# Altium schematic sheet Sheet_CL-TPI-01.SchDoc: Three-phase Inverter
size A3; Author: Canaan Lv; DocumentNumber: CL-TPI-01; Revision: v1.1
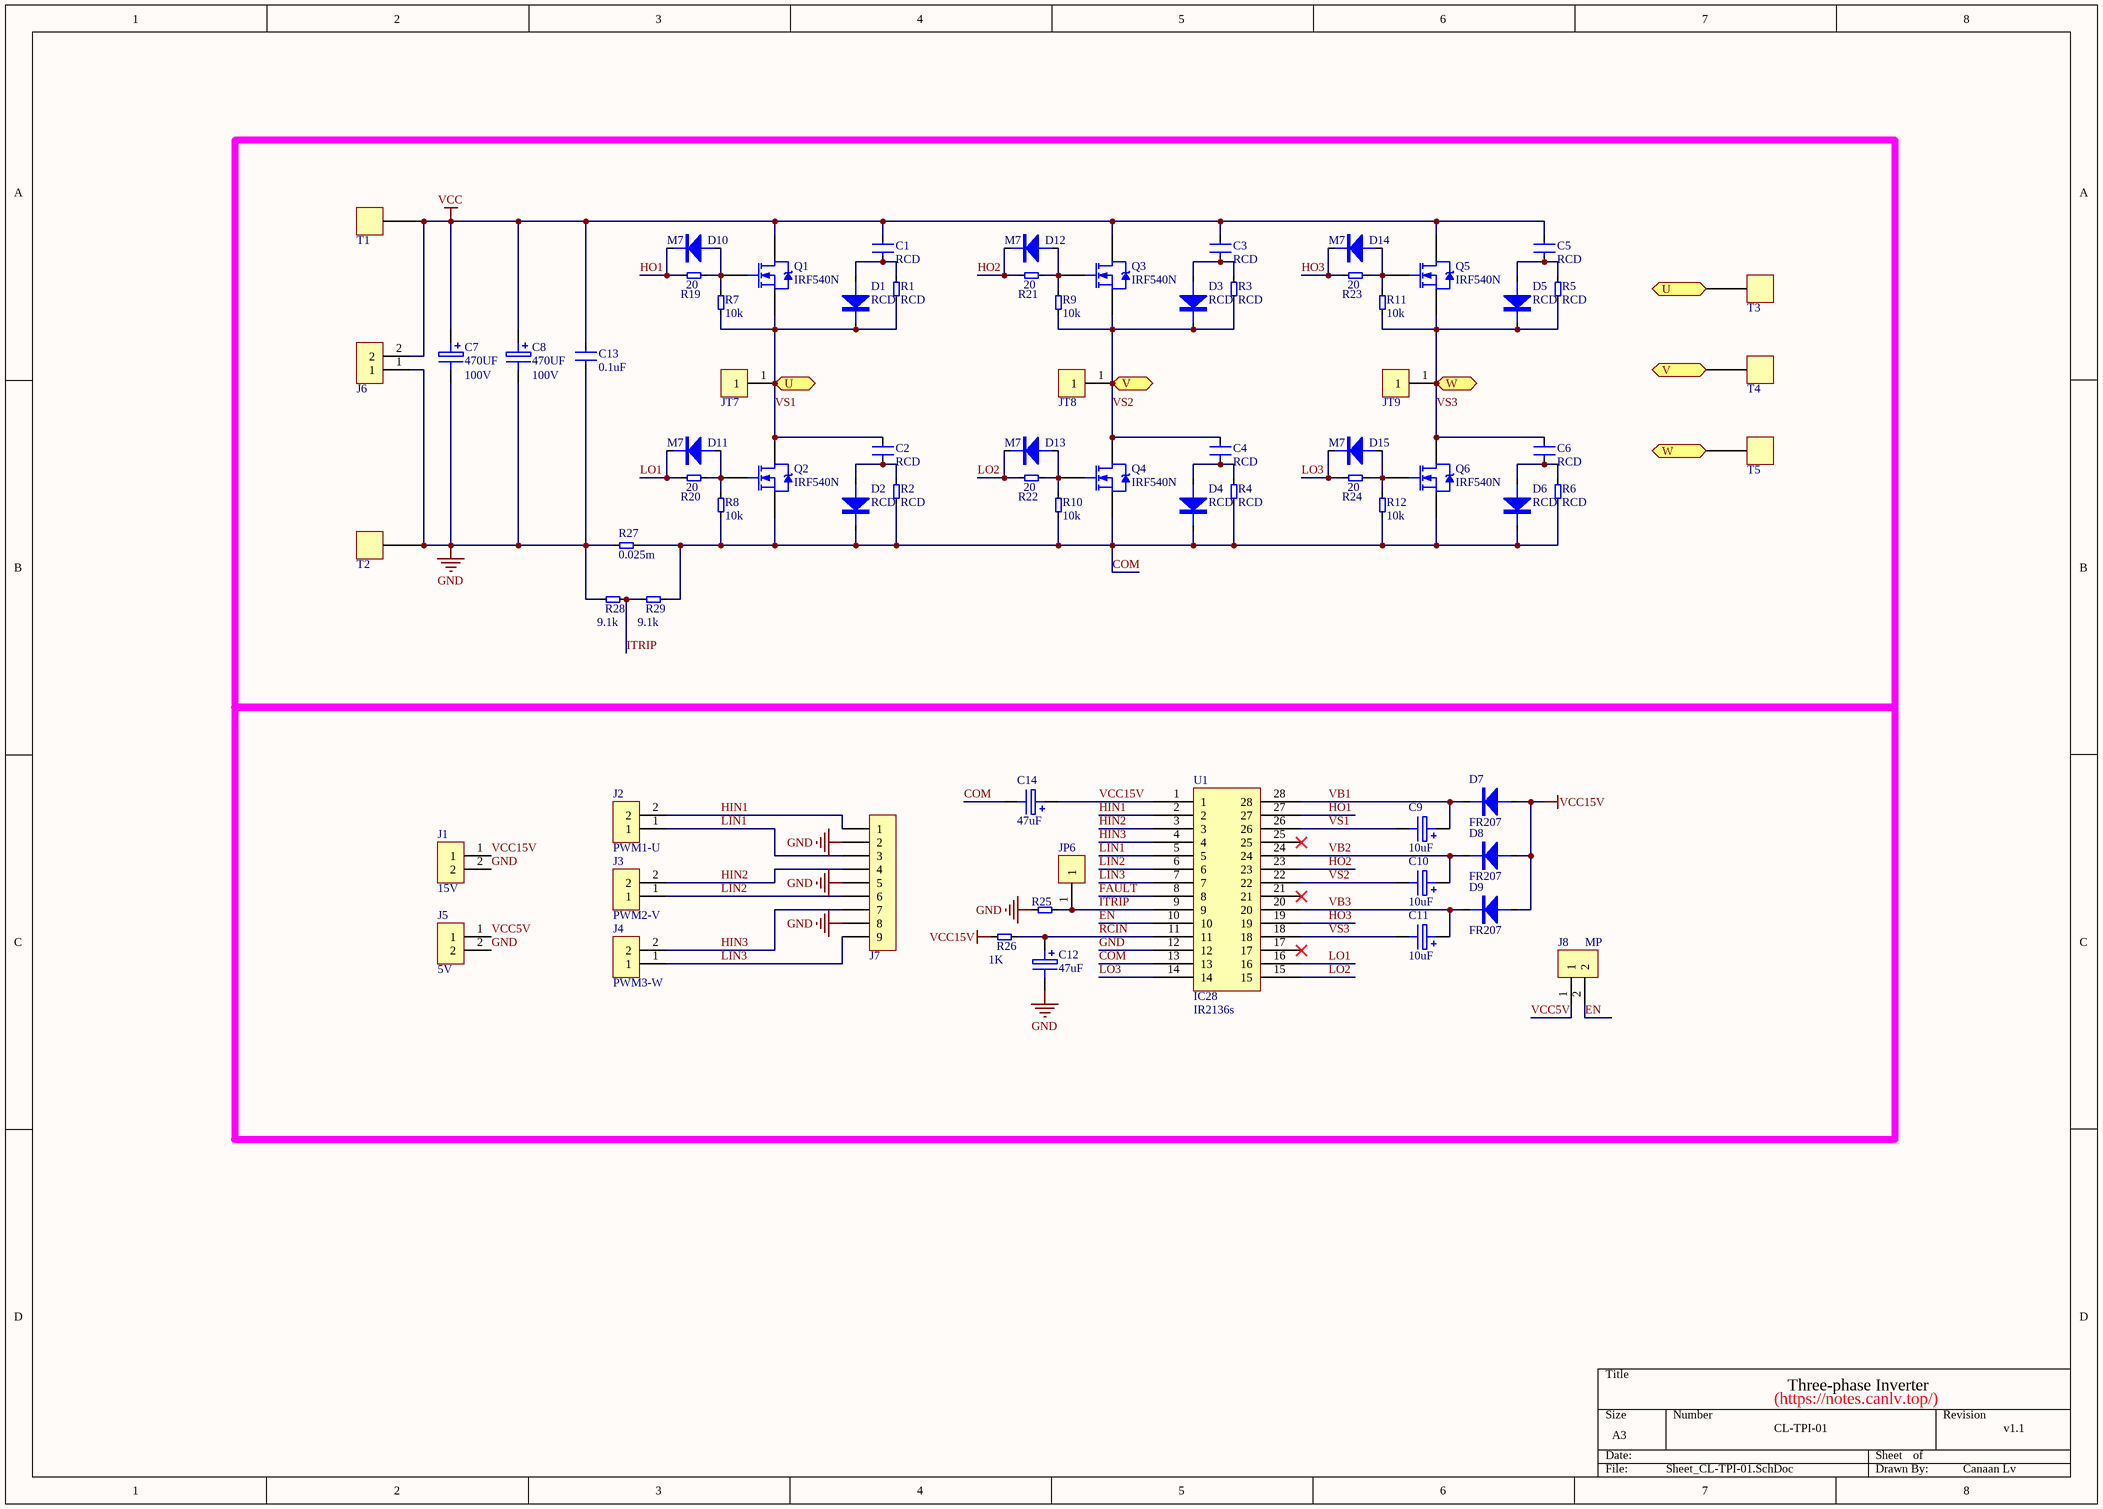
[diagram p0: Sheet_CL-TPI-01.SchDoc]

## Parts
C1  RCD  [C0805]
C2  RCD  [C0805]
C3  RCD  [C0805]
C4  RCD  [C0805]
C5  RCD  [C0805]
C6  RCD  [C0805]
C7  470UF  [CZ16X25]
C8  470UF  [CZ16X25]
C9  10uF  [CZ0.50/25V47U]
C10  10uF  [CZ0.50/25V47U]
C11  10uF  [CZ0.50/25V47U]
C12  47uF  [CZ0.50/25V47U]
C13  0.1uF  [C0805]
C14  47uF  [CZ0.50/25V47U]
D1  RCD  [SMA-1]
D2  RCD  [SMA-1]
D3  RCD  [SMA-1]
D4  RCD  [SMA-1]
D5  RCD  [SMA-1]
D6  RCD  [SMA-1]
D7  FR207  [DO-41-2]
D8  FR207  [DO-41-2]
D9  FR207  [DO-41-2]
D10  M7  [SMA-1]
D11  M7  [SMA-1]
D12  M7  [SMA-1]
D13  M7  [SMA-1]
D14  M7  [SMA-1]
D15  M7  [SMA-1]
J1  15V  [2.54XH接插件2P]
J2  PWM1-U  [2.54XH接插件2P]
J3  PWM2-V  [2.54XH接插件2P]
J4  PWM3-W  [2.54XH接插件2P]
J5  5V  [2.54XH接插件2P]
J6  SIP-2  [2.54XH接插件2P]  (value not drawn)
J7  SIP-9  [2.54排针1X9]  (value not drawn)
J8  MP  [2.54排针1X2]
JP6  SIP-1  [2.54排针1X1]  (value not drawn)
JT7  SIP-1  [2.54排针1X1]  (value not drawn)
JT8  SIP-1  [2.54排针1X1]  (value not drawn)
JT9  SIP-1  [2.54排针1X1]  (value not drawn)
Q1  IRF540N  [TO-220AB]
Q2  IRF540N  [TO-220AB]
Q3  IRF540N  [TO-220AB]
Q4  IRF540N  [TO-220AB]
Q5  IRF540N  [TO-220AB]
Q6  IRF540N  [TO-220AB]
R1  RCD  [R0805]
R2  RCD  [R0805]
R3  RCD  [R0805]
R4  RCD  [R0805]
R5  RCD  [R0805]
R6  RCD  [R0805]
R7  10k  [R0805]
R8  10k  [R0805]
R9  10k  [R0805]
R10  10k  [R0805]
R11  10k  [R0805]
R12  10k  [R0805]
R19  20  [R0805]
R20  20  [R0805]
R21  20  [R0805]
R22  20  [R0805]
R23  20  [R0805]
R24  20  [R0805]
R25  (no value)  [R0805]
R26  (no value)  [R0805]
R27  0.025m  [R2512]
R28  R贴片电阻  [R0805]  (value not drawn)
R29  R贴片电阻  [R0805]  (value not drawn)
T1  香蕉头接线柱  [香蕉接线柱Red_6mm]  (value not drawn)
T2  香蕉头接线柱  [香蕉接线柱Black_6mm]  (value not drawn)
T3  香蕉头接线柱  [香蕉接线柱Black_6mm]  (value not drawn)
T4  香蕉头接线柱  [香蕉接线柱Black_6mm]  (value not drawn)
T5  香蕉头接线柱  [香蕉接线柱Black_6mm]  (value not drawn)
U1  IC28  [SOIC-28_300MIL]

## Ports
U (in), U (out), V (in), V (out), W (in), W (out)

## Nets
GND: C7.2 C8.2 C12.2 C13.2 J1.2 J5.2 J6.1 J7.2 J7.5 J7.8 R25.1 R27.1 R28.1 T2.1 U1.12
VCC: C1.1 C3.1 C5.1 C7.1 C8.1 C13.1 J6.2 Q1.2(D) Q3.2(D) Q5.2(D) T1.1
VCC15V: C14.1 D7.A D8.A D9.A J1.1 R26.1 U1.1
COM: C14.2 D2.K D4.K D6.K Q2.3(S) Q4.3(S) Q6.3(S) R2.1 R4.1 R6.1 R8.1 R10.1 R12.1 R27.2 R29.2 U1.13
EN: J8.2 U1.10
FAULT: U1.8
HIN1: J2.2 J7.1 U1.2
HIN2: J3.2 J7.4 U1.3
HIN3: J4.2 J7.7 U1.4
HO1: D10.K R19.1 U1.27
HO2: D12.K R21.1 U1.23
HO3: D14.K R23.1 U1.19
ITRIP: JP6.1 R25.2 R28.2 R29.1 U1.9
LIN1: J2.1 J7.3 U1.5
LIN2: J3.1 J7.6 U1.6
LIN3: J4.1 J7.9 U1.7
LO1: D11.K R20.1 U1.16
LO2: D13.K R22.1 U1.15
LO3: D15.K R24.1 U1.14
RCIN: C12.1 R26.2 U1.11
VB1: C9.1 D7.K U1.28
VB2: C10.1 D8.K U1.24
VB3: C11.1 D9.K U1.20
VCC5V: J5.1 J8.1
VS1: C2.1 C9.2 D1.K JT7.1 Q1.3(S) Q2.2(D) R1.1 R7.1 T3.1 U1.26 ; port U
VS2: C4.1 C10.2 D3.K JT8.1 Q3.3(S) Q4.2(D) R3.1 R9.1 T4.1 U1.22 ; port V
VS3: C6.1 C11.2 D5.K JT9.1 Q5.3(S) Q6.2(D) R5.1 R11.1 T5.1 U1.18 ; port W
NetC1_2: C1.2 D1.A R1.2
NetC2_2: C2.2 D2.A R2.2
NetC3_2: C3.2 D3.A R3.2
NetC4_2: C4.2 D4.A R4.2
NetC5_2: C5.2 D5.A R5.2
NetC6_2: C6.2 D6.A R6.2
NetD10_A: D10.A Q1.1(G) R7.2 R19.2
NetD11_A: D11.A Q2.1(G) R8.2 R20.2
NetD12_A: D12.A Q3.1(G) R9.2 R21.2
NetD13_A: D13.A Q4.1(G) R10.2 R22.2
NetD14_A: D14.A Q5.1(G) R11.2 R23.2
NetD15_A: D15.A Q6.1(G) R12.2 R24.2

Not connected (* = marked no-connect by the designer): U1 17* 21* 25*

## Notes on the sheet
- (https://notes.canlv.top/)
- (in symbol C直插电容) 100V
- (in symbol IC28) IR2136s
- (in symbol R贴片电阻) 1K; 9.1k

## Library data of the parts
C1-C6 C13 = C贴片电容
C7-C12 C14 = C直插电容
D1-D6 D10-D15 = 0805D
D7-D9 = DO-41
J1-J5 J8 = SIP-2
Q1-Q6 = IRF540N: HEXFET Power MOSFET; Note: Pin 2 is electrically connected to pin 4.; Sim Note: Thermal Model provided is not called on from main Subckt.; Published: 8-Jun-2000; LatestRevisionDate: 17-Jul-2002; LatestRevisionNote: Re-released for DXP Platform.; DatasheetVersion: May-1998; PackageVersion: Feb-1997; PackageReference: TO-220AB; Publisher: Altium Limited; PackageDescription: TO, Thru-Hole, Vertical, Heatsink Mounted; 3 In-Line Leads; Pitch 2.54 mm; ComponentLink1Description: Manufacturer Link; ComponentLink1URL: http://www.irf.com/; ComponentLink2Description: Datasheet; ComponentLink2URL: http://www.irf.com/product-info/datasheets/data/irf540n.pdf
R1-R12 R19-R27 = R贴片电阻